# Altium schematic sheet PSU.SchDoc
size A3; SheetNumber: 1; SheetTotal: 1
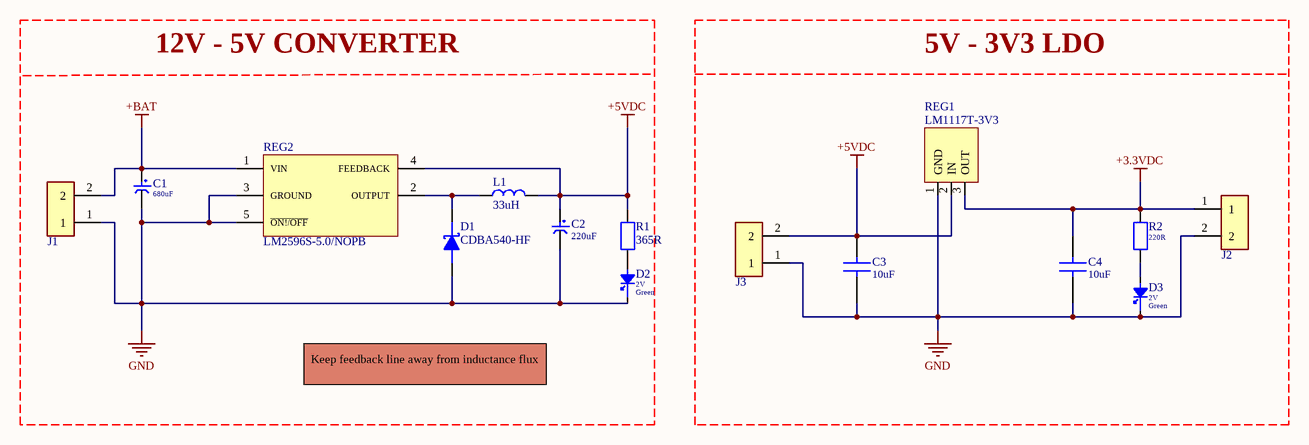
[diagram p0: PSU.SchDoc]

## Parts
C1  Capacitance: 680uF  [CAP ALI 10MM RADIAL]  (hidden comment: EEU-FR1V681)
C2  Capacitance: 220uF  [CAP ALI 6.30MM RADIAL]  (hidden comment: ESH227M016AE3AA)
C3  Capacitance: 10uF  [CAP CER 0805]  (hidden comment: GRM21BR61E106MA73L)
C4  Capacitance: 10uF  [CAP CER 0805]  (hidden comment: GRM21BR61E106MA73L)
D1  CDBA540-HF  [DO-214AC]
D2  Forward Voltage: 2V  Color: Green  [LED GR 0603]  (hidden comment: 150060VS75000)
D3  Forward Voltage: 2V  Color: Green  [LED GR 0603]  (hidden comment: 150060VS75000)
J1  2X1 KLEMENS  [2X1 CONNECTOR]  (value not drawn)
J2  2X1 KLEMENS  [2X1 CONNECTOR]  (value not drawn)
J3  2X1 KLEMENS  [2X1 CONNECTOR]  (value not drawn)
L1  Inductance: 33uH  [SRR1280-330M]  (hidden comment: SRR1280-330M)
R1  Resistance: 365R  [RES 0805]  (hidden comment: RC0805FR-07365RL)
R2  value 220R  [RES 0805]  (hidden comment: RES 220R 0805)
REG1  LM1117T-3V3  [LM1117-3V3]
REG2  LM2596S-5.0/NOPB  [LM2596S-5.0/NOPB]

## Blocks framed on the sheet
12V - 5V CONVERTER: C1 C2 D1 D2 J1 L1 R1 REG2
5V - 3V3 LDO: C3 C4 D3 J2 J3 R2 REG1

## Nets
+3.3VDC: C4.2 J2.1 R2.2 REG1.3(OUT)
+5VDC: C2.1 C3.2 J3.2 L1.2 R1.2 REG1.2(IN) REG2.4(FEEDBACK)
+BAT: C1.1 J1.2 REG2.1(VIN)
GND: C1.2 C2.2 C3.1 C4.1 D1.A D2.1 D3.1 J1.1 J2.2 J3.1 REG1.1(GND) REG2.3(GROUND) REG2.5(~{ON!/OFF})
NetD1_C: D1.C L1.1 REG2.2(OUTPUT)
NetD2_2: D2.2 R1.1
NetD3_2: D3.2 R2.1

## Notes on the sheet
- self-protected from short-circuit conditions and overtemperature.
- Keep feedback line away from inductance flux

## Library data of the parts
C1 = CAP ALUM 680UF 35V  RADIAL: CAP ALUM 680UF 20% 35V RADIAL; Manufacturer: Panasonic; Ripple Current: 2.18A; Impedance: 20mR; Life (Hours): 10000Hour; Lead/Base Style: Straight; Leakage Current: 3uA; Lead Diameter: 0.6mm; Supplier 1: Digi-Key; Manufacturer Part Number: EEU-FR1V681; RoHS: Yes; Category: Aluminum Electrolytic Capacitors; Stock 1: 13043; Pricing 1: 1=1.09000, 10=0.82700, 50=0.68680, 100=0.59140, 500=0.45788, 1000=0.39429, 2500=0.36885, 5000=0.34977 (USD); Mount: Through Hole; Case/Package: Radial; Number of Pins: 2; Contact Plating: Tin; Min Operating Temperature: -40°C; Max Operating Temperature: 105°C; Tolerance: 20%; Termination: Radial; Voltage Rating: 35V; Packaging: Bulk; Package Quantity: 200; Voltage Rating (DC): 35V; ESR (Equivalent Series Resistance): 20mR; Series: FR; Ripple Current (AC): 2.18A; Voltage: 35V; Construction: RADIAL; Diameter: 10mm; Length: 20mm; Height: 20mm; Lead Pitch: 5mm; Height - Seated (Max): 0.866inch; Radiation Hardening: No; REACH SVHC: Unknown; RoHS Compliant: Yes; ComponentLink1URL: https://datasheet.ciiva.com/11780/0900766b80e4e9bf-11780986.pdf?src-supplier=RSComponents; ComponentLink1Description: https://datasheet.ciiva.com/11780/0900766b80e4e9bf-11780986.pdf?src-supplier=RSComponents; ComponentLink2URL: https://datasheet.ciiva.com/11677/aba0000ce132-11677717.pdf?src-supplier=Avnet; ComponentLink2Description: https://datasheet.ciiva.com/11677/aba0000ce132-11677717.pdf?src-supplier=Avnet; ComponentLink3URL: https://datasheet.ciiva.com/14602/70257620-14602587.pdf?src-supplier=Allied+Electronics; ComponentLink3Description: https://datasheet.ciiva.com/14602/70257620-14602587.pdf?src-supplier=Allied+Electronics; ComponentLink4URL: https://datasheet.ciiva.com/30145/9aba0000ce132-30145388.pdf?src-supplier=Onlinecomponents.com; ComponentLink4Description: https://datasheet.ciiva.com/30145/9aba0000ce132-30145388.pdf?src-supplier=Onlinecomponents.com; ComponentLink5URL: https://datasheet.ciiva.com/17531/aba0000ce132-17531901.pdf?src-supplier=Avnet+Europe; ComponentLink5Description: https://datasheet.ciiva.com/17531/aba0000ce132-17531901.pdf?src-supplier=Avnet+Europe; Supplier Part Number 1: P14514-ND; Weight: 2.5
C2 = CAP ALUM 220UF 16V  RADIAL_1: Capacitor;  Al Electrolytic;  Cap 220 uF;  Tol 20%;  Vol-Rtg 16 VDC;  Radial;  6x11 mm; Manufacturer: KEMET; Dielectric Material: Aluminium; Voltage Rating: 16V; Ripple Current: 235mA; Leakage Current: 35.2uA; Life (Hours): 2000Hour; Dissipation Factor: 18%; Lead Diameter: 0.5mm; Lead Length: 20mm; Supplier 1: Digi-Key; Manufacturer Part Number: ESH227M016AE3AA; RoHS: Yes; Category: Aluminum Electrolytic Capacitors; Stock 1: 8987; Pricing 1: 1=0.26000, 10=0.17700, 50=0.11780, 100=0.10010, 500=0.07066, 1000=0.06182, 2500=0.05888, 5000=0.05446 (USD); Mount: Through Hole,PCB; Case/Package: Radial; Min Operating Temperature: -40°C; Max Operating Temperature: 105°C; Package Quantity: 10000; Packaging: Bulk; Tolerance: 20%; Voltage Rating (DC): 16V; Termination: Radial; Voltage: 16V; Features: General Purpose; Series: ESH; Diameter: 6.3mm; Length: 11mm; Height: 11mm; Lead Pitch: 0.098inch; Height - Seated (Max): 0.492inch; RoHS Compliant: Yes; ComponentLink1URL: https://datasheet.ciiva.com/14587/70233271-14587391.pdf?src-supplier=Allied+Electronics; ComponentLink1Description: https://datasheet.ciiva.com/14587/70233271-14587391.pdf?src-supplier=Allied+Electronics; Supplier Part Number 1: 399-6566-ND; Weight: 0.6
C3 C4 = CAP CER 10UF 25V 0805: MURATA - GRM21BR61E106MA73L - SMD Multilayer Ceramic Capacitor, 10 µF, 25 V, 0805 [2012 Metric], ± 20%, X5R, GRM Series; Voltage Rating: 25V; Supplier 1: Digi-Key; Manufacturer: Murata; Manufacturer Part Number: GRM21BR61E106MA73L; RoHS: Yes; Category: Ceramic Capacitors; Stock 1: 318119; Pricing 1: 1=0.26000, 10=0.17900, 50=0.11960, 100=0.10170, 500=0.07176, 1000=0.06279 (USD); Mount: Surface Mount; Case/Package: 0805; Case Code (Metric): 2012; Case Code (Imperial): 0805; Weight: 0.000335oz; Min Operating Temperature: -55°C; Max Operating Temperature: 85°C; Tolerance: 20%; Packaging: Tape and Reel; Dielectric: X5R; Termination: SMD/SMT; Resistor Type: Ceramic; Voltage Rating (DC): 25V; Package Quantity: 3000; Length: 2mm; Width: 0.049inch; Height: 1.25mm; Thickness: 0.055inch; Depth: 1.25mm; REACH SVHC: No SVHC; Lead Free: Lead Free; RoHS Compliant: Yes; ComponentLink1URL: http://www.farnell.com/datasheets/2079185.pdf?src-supplier=Farnell; ComponentLink1Description: http://www.farnell.com/datasheets/2079185.pdf?src-supplier=Farnell; ComponentLink2URL: http://www.mouser.com/ds/2/281/c02e-2905.pdf?src-supplier=Mouser; ComponentLink2Description: http://www.mouser.com/ds/2/281/c02e-2905.pdf?src-supplier=Mouser; ComponentLink3URL: http://components.arrow.com/part/dataview/0323_03061623?src-supplier=Arrow+Europe; ComponentLink3Description: http://components.arrow.com/part/dataview/0323_03061623?src-supplier=Arrow+Europe; ComponentLink4URL: https://search.murata.co.jp/Ceramy/image/img/A01X/G101/ENG/GRM21BR61E106MA73-01.pdf?src-supplier=Digi-Key; ComponentLink4Description: https://search.murata.co.jp/Ceramy/image/img/A01X/G101/ENG/GRM21BR61E106MA73-01.pdf?src-supplier=Digi-Key; ComponentLink5URL: http://www.farnell.com/datasheets/2079185.pdf?src-supplier=Element14; ComponentLink5Description: http://www.farnell.com/datasheets/2079185.pdf?src-supplier=Element14; Supplier Part Number 1: 490-10748-1-ND
D1 = CDBA540-HF: DIODE SCHOTTKY 40V 5A DO214AC; Manufacturer: Comchip; Supplier 1: Digi-Key; Manufacturer Part Number: CDBA540-HF; RoHS: Yes; Category: Rectifier Diodes; Stock 1: 101065; Pricing 1: 1=0.51000, 10=0.41000, 100=0.27930, 500=0.20948, 1000=0.15711, 2000=0.14402 (USD); Mount: Surface Mount; Packaging: Tape and Reel; Average Rectified Current: 5A; Max Reverse Voltage (DC): 40V; Series: -; RoHS Compliant: Yes; ComponentLink1URL: http://www.mouser.com/ds/2/80/CDBA520-HF%20Thru134737.%20CDBA5200-HF%20RevB-221146.pdf?src-supplier=Mouser; ComponentLink1Description: http://www.mouser.com/ds/2/80/CDBA520-HF%20Thru134737.%20CDBA5200-HF%20RevB-221146.pdf?src-supplier=Mouser; ComponentLink2URL: http://www.comchiptech.com/admin/files/product/CDBA540-HF%20Thru504741.%20CDBA5200-HF%20RevC.pdf?src-supplier=Digi-Key; ComponentLink2Description: http://www.comchiptech.com/admin/files/product/CDBA540-HF%20Thru504741.%20CDBA5200-HF%20RevC.pdf?src-supplier=Digi-Key; Supplier Part Number 1: 641-1707-1-ND
D2 D3 = LED GR 0603: CRCW Thick Film Commodity Chip Resistor 0603 Size 5.1K Ohm 1% 0.1 W 100 ppm/K 2-Pin SMD Paper T/R; Manufacturer: Wurth Electronics; Luminous Intensity: 40mcd; Viewing Angle: 140°; Wavelength: 570nm; Lens Style: Clear,Rectangular; Forward Current: 30mA; Resistance: 5.1kR; Max Power Dissipation: 100mW; Temperature Coefficient: 100ppm/°C; Test Current: 20mA; Supplier 1: Digi-Key; Manufacturer Part Number: 150060VS75000; RoHS: Yes; Category: LEDs; Stock 1: 170555; Pricing 1: 1=0.14000, 50=0.13300, 100=0.11400, 500=0.10500, 1000=0.09900 (USD); Mount: Surface Mount; Case/Package: 0603; Number of Pins: 2; Case Code (Metric): 1608; Case Code (Imperial): 0603; Min Operating Temperature: -40°C; Max Operating Temperature: 85°C; Package Quantity: 1; Packaging: Tape and Reel; Dominant Wavelength: 570nm; Length: 1.6mm; Width: 0.8mm; Height: 0.7mm; REACH SVHC: Unknown; RoHS Compliant: Yes; ComponentLink1URL: https://datasheet.ciiva.com/29562/150060vs75000-29562919.pdf?src-supplier=Digi-Key; ComponentLink1Description: https://datasheet.ciiva.com/29562/150060vs75000-29562919.pdf?src-supplier=Digi-Key; Supplier Part Number 1: 732-4980-1-ND; Supplier 2: Digi-Key; Stock 2: 49532; Pricing 2: 1=0.10000, 10=0.03600, 100=0.01450, 1000=0.00652, 2500=0.00566, 5000=0.00468 (USD); Resistor Type: Thick Film; Tolerance: 1%; Number of Terminations: 2; ComponentLink2URL: http://www.vishay.com/docs/28773/crcwce3.pdf?src-supplier=Digi-Key; ComponentLink2Description: http://www.vishay.com/docs/28773/crcwce3.pdf?src-supplier=Digi-Key; Supplier Part Number 2: 541-CRCW06035K10FKEBCCT-ND; Weight: 0.025
J1-J3 = 2X1 KLEMENS: Conn PC Terminal Block 2 POS 5mm Solder ST Thru-Hole 17.5A; Manufacturer: Phoenix Contact; Manufacturer Part Number: 1935161; Number of Contacts: 2; Max Current Rating: 16A; Max Supply Voltage: 250V; Number of Levels: 1; Current: 18A; Voltage: 300V; Voltage Rating (DC): 320V; Connector Type: Screw; Wire/Cable Gauge: 26AWG; Wire Gauge (Min): 12AWG; Approvals: UL; Supplier 1: Digi-Key; RoHS: Yes; Category: Terminal Blocks; Stock 1: 135087; Pricing 1: 1=0.47000, 10=0.44900, 50=0.42900, 100=0.41730, 250=0.39000, 500=0.37128 (USD); Mount: Through Hole; Number of Pins: 2; Contact Material: Copper,Tin; Housing Material: Polyamide; Color: Green; Weight: 0.067021oz; Material: Nylon; Housing Color: Green; Insulation Material: Nylon; Current Rating: 17.5A; Number of Rows: 1; Termination: Solder; Orientation: Straight; Voltage Rating: 250V; Package Quantity: 250; Packaging: Bulk; Number of Poles: 2; Number of Positions: 2; Number of Positions Per Level: 2; Number of Circuits: 2; Series: COMBICON PT; Number of Ways: 2; Length: 9mm; Width: 14.9mm; Height: 11.3mm; Wire Gauge (Max): 26AWG; Depth: 9mm; Pitch: 5mm; Radiation Hardening: No; RoHS Compliant: Yes; Lead Free: Lead Free; Flammability Rating: UL94 V-0; REACH SVHC: Unknown; ComponentLink1URL: https://datasheet.ciiva.com/16047/1935161-16047247.pdf?src-supplier=Onlinecomponents.com; ComponentLink1Description: https://datasheet.ciiva.com/16047/1935161-16047247.pdf?src-supplier=Onlinecomponents.com; ComponentLink2URL: https://datasheet.ciiva.com/15169/getdatasheetpartid-177903-15169663.pdf?src-supplier=Verical; ComponentLink2Description: https://datasheet.ciiva.com/15169/getdatasheetpartid-177903-15169663.pdf?src-supplier=Verical; ComponentLink3URL: https://datasheet.ciiva.com/824/combiconcompact5-0mmseries-824222.pdf?src-supplier=Digi-Key; ComponentLink3Description: https://datasheet.ciiva.com/824/combiconcompact5-0mmseries-824222.pdf?src-supplier=Digi-Key; Supplier Part Number 1: 277-1667-ND
L1 = IND 33uH: 33uH 20% 100KHz Ind Power Shielded Wirewound  28Q-Factor Ferrite 3.5A T/R; Manufacturer: Bourns; Material: Steel; DC Resistance (DCR): 57mR; Saturation Current: 3.3A; Self Resonant Frequency: 9.5MHz; Q Factor: 28; Supplier 1: Digi-Key; Manufacturer Part Number: SRR1280-330M; RoHS: Yes; Category: Fixed Inductors; Stock 1: 7352; Pricing 1: 1=1.25000, 10=1.16400, 25=1.07400, 50=0.89520, 100=0.84140 (USD); Mount: Surface Mount; Case/Package: Nonstandard; Number of Pins: 2; Core Material: Ferrite; Min Operating Temperature: -40°C; Max Operating Temperature: 125°C; Tolerance: 20%; Max DC Current: 3.5A; Package Quantity: 400; Current Rating: 3.5A; Shielding: Shielded; Packaging: Tape and Reel; Resistor Type: Wirewound; Test Frequency: 100kHz; Series: SRR1280; Inductance Tolerance: 20%; Resistance: 57MR; Termination: SMD/SMT; RMS Current (Irms): 3.5A; Frequency: 9.5MHz; DC Current: 3.5A; Sample Rate (Hz): 100kHz; Length: 12.5mm; Width: 12.5mm; Height: 7.5mm; Height - Seated (Max): 0.315inch; Depth: 12.8mm; Radiation Hardening: No; RoHS Compliant: Yes; REACH SVHC: No SVHC; Military Standard: Not; ComponentLink1URL: https://datasheet.ciiva.com/11799/0900766b80ddd400-11799870.pdf?src-supplier=RSComponents; ComponentLink1Description: https://datasheet.ciiva.com/11799/0900766b80ddd400-11799870.pdf?src-supplier=RSComponents; ComponentLink2URL: https://datasheet.ciiva.com/17112/70277071-17112985.pdf?src-supplier=Allied+Electronics; ComponentLink2Description: https://datasheet.ciiva.com/17112/70277071-17112985.pdf?src-supplier=Allied+Electronics; ComponentLink3URL: https://datasheet.ciiva.com/8512/srr1280-8512893.pdf?src-supplier=Avnet; ComponentLink3Description: https://datasheet.ciiva.com/8512/srr1280-8512893.pdf?src-supplier=Avnet; ComponentLink4URL: https://datasheet.ciiva.com/6696/srr1280-6696735.pdf?src-supplier=Digi-Key; ComponentLink4Description: https://datasheet.ciiva.com/6696/srr1280-6696735.pdf?src-supplier=Digi-Key; ComponentLink5URL: https://datasheet.ciiva.com/17285/srr1280-17285215.pdf?src-supplier=Avnet+Europe; ComponentLink5Description: https://datasheet.ciiva.com/17285/srr1280-17285215.pdf?src-supplier=Avnet+Europe; ComponentLink6URL: https://datasheet.ciiva.com/30162/srr1280-30162751.pdf?src-supplier=Onlinecomponents.com; ComponentLink6Description: https://datasheet.ciiva.com/30162/srr1280-30162751.pdf?src-supplier=Onlinecomponents.com; ComponentLink7URL: https://datasheet.ciiva.com/48488/srr1280-48488287.pdf?src-supplier=Avnet; ComponentLink7Description: https://datasheet.ciiva.com/48488/srr1280-48488287.pdf?src-supplier=Avnet; Supplier Part Number 1: SRR1280-330MCT-ND; Weight: 4.2
R1 = RES 365R 0805: RES SMD 365 OHM 1% 1/8W 0805; Manufacturer: Yageo; Power Rating: 125mW; Voltage Rating: 150V; Temperature Coefficient: 100ppm/°C; Supplier 1: Digi-Key; Manufacturer Part Number: RC0805FR-07365RL; RoHS: Yes; Category: Chip SMD Resistors; Stock 1: 53868; Pricing 1: 1=0.10000, 10=0.04200, 100=0.01690, 1000=0.00759, 2500=0.00659 (USD); Case/Package: 0805; Case Code (Imperial): 0805; Case Code (Metric): 2012; Size Code: 0805; Min Operating Temperature: -55°C; Max Operating Temperature: 155°C; Packaging: Tape and Reel; Tolerance: 1%; Termination: SMD/SMT; Resistor Type: Thick Film; Voltage Rating (DC): 150V; Features: Moisture Resistant; Series: RC; Max Power Dissipation: 125mW; Number of Terminations: 2; Construction: Rectangular; Length: 2mm; Width: 1.25mm; Height: 0.5mm; Depth: 1.25mm; Military Standard: Not; Lead Free: Lead Free; RoHS Compliant: Yes; ComponentLink1URL: http://components.arrow.com/part/dataview/0323_03541250?src-supplier=Arrow+Europe; ComponentLink1Description: http://components.arrow.com/part/dataview/0323_03541250?src-supplier=Arrow+Europe; ComponentLink2URL: http://www.yageo.com/documents/recent/PYu-RC_Group_51_RoHS_L_9.pdf?src-supplier=Digi-Key; ComponentLink2Description: http://www.yageo.com/documents/recent/PYu-RC_Group_51_RoHS_L_9.pdf?src-supplier=Digi-Key; ComponentLink3URL: http://www.yageo.ru/pdf/RC0805.pdf?src-supplier=Mouser; ComponentLink3Description: http://www.yageo.ru/pdf/RC0805.pdf?src-supplier=Mouser; ComponentLink4URL: http://www.yageo.ru/pdf/RC0805.pdf?src-supplier=Future+Electronics; ComponentLink4Description: http://www.yageo.ru/pdf/RC0805.pdf?src-supplier=Future+Electronics; ComponentLink5URL: http://www.yageo.com.tw/exep/pages/download/literatures/PYu-R_INT-thick_7.pdf?src-supplier=Digi-Key; ComponentLink5Description: http://www.yageo.com.tw/exep/pages/download/literatures/PYu-R_INT-thick_7.pdf?src-supplier=Digi-Key; Supplier Part Number 1: 311-365CRCT-ND; Weight: 0.002
R2 = RES 220R 0805: Res Thick Film 0805 220 Ohm 5% 0.125W(1/8W) ±100ppm/C Pad SMD Automotive T/R; Manufacturer: TE Connectivity; Manufacturer Part Number: CRGCQ0805J220R; Supplier 1: Digi-Key; RoHS: Yes; Category: Chip SMD Resistors; Stock 1: 66860; Pricing 1: 1=0.10000, 10=0.04300, 100=0.01740, 1000=0.00783, 2500=0.00680 (USD); RoHS Compliant: Yes; Supplier Part Number 1: A130130CT-ND
REG1 = LM1117T-3V3: 800-mA 15-V linear voltage regulator 3-TO-220 0 to 125; Manufacturer: TI National Semiconductor; Manufacturer Part Number: LM1117T-3.3/NOPB; Max Input Voltage: 15V; Output Voltage: 3.3V; Output Current: 800mA; Number of Outputs: 1; Dropout Voltage: 1.2V; Polarity: Positive; Quiescent Current: 10mA; Accuracy: 1%; Current Rating: 800A; Output Type: Fixed; Supplier 1: Mouser; RoHS: Yes; Category: Voltage Regulators - Linear; Stock 1: 1900; Pricing 1: 1=1.77000, 10=1.59000, 50=1.50000, 100=1.50000, 1000=1.50000, 10000=1.50000 (USD); Mount: Through Hole; Case/Package: TO-220; Number of Pins: 3; Weight: 0.01lb; Contact Plating: Tin,Matte; Min Operating Temperature: -40°C; Max Operating Temperature: 125°C; Package Quantity: 45; Packaging: Rail/Tube; Max Output Current: 800mA; Nominal Output Voltage: 3.3V; Output Voltage Accuracy: 1%; Length: 10.16mm; Width: 4.7mm; Height: 8.89mm; Radiation Hardening: No; REACH SVHC: No SVHC; Lead Free: Lead Free; RoHS Compliant: Yes; ComponentLink1URL: https://datasheet.ciiva.com/15111/getdatasheetpartid-67377-15111321.pdf?src-supplier=Verical; ComponentLink1Description: https://datasheet.ciiva.com/15111/getdatasheetpartid-67377-15111321.pdf?src-supplier=Verical; ComponentLink2URL: https://datasheet.ciiva.com/19480/242115-19480555.pdf?src-supplier=Jameco; ComponentLink2Description: https://datasheet.ciiva.com/19480/242115-19480555.pdf?src-supplier=Jameco; ComponentLink3URL: https://datasheet.ciiva.com/41457/001013630-da-01-en-ic-reg-ldo-lm1117t-3-3-nopb-to-220-3-tid-41457409.pdf?src-supplier=Conrad; ComponentLink3Description: https://datasheet.ciiva.com/41457/001013630-da-01-en-ic-reg-ldo-lm1117t-3-3-nopb-to-220-3-tid-41457409.pdf?src-supplier=Conrad; ComponentLink4URL: https://datasheet.ciiva.com/26904/lm1117t-3-3-nopb-26904894.pdf?src-supplier=IIIC; ComponentLink4Description: https://datasheet.ciiva.com/26904/lm1117t-3-3-nopb-26904894.pdf?src-supplier=IIIC; ComponentLink5URL: https://datasheet.ciiva.com/1511/1882372-1511717.pdf?src-supplier=Element14; ComponentLink5Description: https://datasheet.ciiva.com/1511/1882372-1511717.pdf?src-supplier=Element14; ComponentLink6URL: https://datasheet.ciiva.com/2047/lm1117-n-2047767.pdf?src-supplier=Digi-Key; ComponentLink6Description: https://datasheet.ciiva.com/2047/lm1117-n-2047767.pdf?src-supplier=Digi-Key; ComponentLink7URL: https://datasheet.ciiva.com/14150/ialm1117t-e-14150010.pdf?src-supplier=Distrelec; ComponentLink7Description: https://datasheet.ciiva.com/14150/ialm1117t-e-14150010.pdf?src-supplier=Distrelec; Supplier Part Number 1: 926-LM1117T-3.3/NOPB
REG2 = LM2596S-5.0/NOPB: Conv DC-DC 4.5V to 40V Inv/Step Down Single-Out 5V 3A 6-Pin(5+Tab) TO-263 Tube; Manufacturer: TI National Semiconductor; Efficiency: 80%; Number of Outputs: 1; Switching Frequency: 173kHz; Quiescent Current: 5mA; Output Type: Fixed; Supplier 1: Mouser; Manufacturer Part Number: LM2596S-5.0/NOPB; RoHS: Yes; Category: Power Supply Modules; Stock 1: 3519; Pricing 1: 1=7.15000, 10=6.46000, 50=6.16000, 100=5.34000, 1000=5.34000, 10000=5.34000 (USD); Mount: Surface Mount; Case/Package: TO-263; Number of Pins: 5; Weight: 0.25lb; Contact Plating: Tin,Matte; Min Operating Temperature: -40°C; Max Operating Temperature: 125°C; Min Input Voltage: 4.5V; Output Current: 3A; Output Voltage: 5V; Packaging: Rail/Tube; Max Output Current: 3A; Max Input Voltage: 40V; Package Quantity: 45; Nominal Output Voltage: 5V; Operating Supply Voltage: 40V; Length: 10.16mm; Width: 8.64mm; Height: 4.57mm; Radiation Hardening: No; REACH SVHC: No SVHC; Lead Free: Contains Lead; ComponentLink1URL: https://datasheet.ciiva.com/15112/getdatasheetpartid-112894-15112928.pdf?src-supplier=Verical; ComponentLink1Description: https://datasheet.ciiva.com/15112/getdatasheetpartid-112894-15112928.pdf?src-supplier=Verical; ComponentLink2URL: https://datasheet.ciiva.com/14150/jqlm2596x-xx-e-14150651.pdf?src-supplier=Distrelec; ComponentLink2Description: https://datasheet.ciiva.com/14150/jqlm2596x-xx-e-14150651.pdf?src-supplier=Distrelec; ComponentLink3URL: https://datasheet.ciiva.com/27050/836385-27050287.pdf?src-supplier=Jameco; ComponentLink3Description: https://datasheet.ciiva.com/27050/836385-27050287.pdf?src-supplier=Jameco; ComponentLink4URL: https://datasheet.ciiva.com/41457/001013813-da-01-en-ic-reg-buc-lm2596s-5-0-nopb-to-263-5-tid-41457757.pdf?src-supplier=Conrad; ComponentLink4Description: https://datasheet.ciiva.com/41457/001013813-da-01-en-ic-reg-buc-lm2596s-5-0-nopb-to-263-5-tid-41457757.pdf?src-supplier=Conrad; ComponentLink5URL: https://datasheet.ciiva.com/6596/lm2596-6596343.pdf?src-supplier=Digi-Key; ComponentLink5Description: https://datasheet.ciiva.com/6596/lm2596-6596343.pdf?src-supplier=Digi-Key; ComponentLink6URL: https://datasheet.ciiva.com/22669/1874590-22669463.pdf?src-supplier=Element14; ComponentLink6Description: https://datasheet.ciiva.com/22669/1874590-22669463.pdf?src-supplier=Element14; ComponentLink7URL: https://datasheet.ciiva.com/16536/lm2596-16536124.pdf?src-supplier=Avnet+Asia; ComponentLink7Description: https://datasheet.ciiva.com/16536/lm2596-16536124.pdf?src-supplier=Avnet+Asia; Supplier Part Number 1: 926-LM2596S-5.0/NOPB